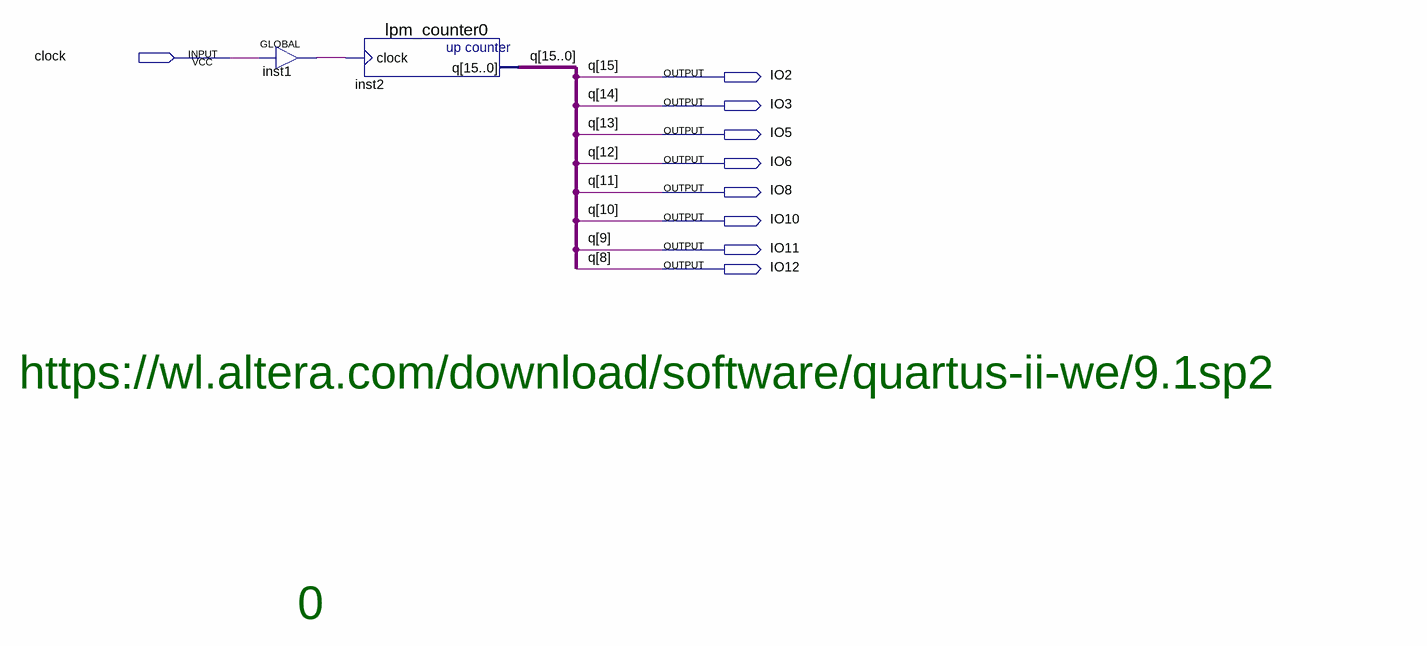
[diagram p0: schematic sheet]
// Quartus schematic block1.bdf as structural Verilog: 2 symbols, 9 pins
module block1 (
  input  clock,
  output IO2,
  output IO3,
  output IO5,
  output IO6,
  output IO8,
  output IO10,
  output IO11,
  output IO12
);

  wire inst1_out;
  wire [7:0] q;

  GLOBAL inst1 (.IN(clock), .OUT(inst1_out));
  lpm_counter0 inst2 (.clock(inst1_out), .q({IO2, IO3, IO5, IO6, IO8, IO10, IO11, IO12, q}));

  // Other names for the same wires on the sheet: q[15:8] = {IO2, IO3, IO5, IO6, IO8, IO10, IO11, IO12}

  // Notes on the sheet:
  //   https://wl.altera.com/download/software/quartus-ii-we/9.1sp2
  //   0
endmodule
